# Altium schematic sheet ESP.SchDoc
size A4; SheetNumber: 2; SheetTotal: 9
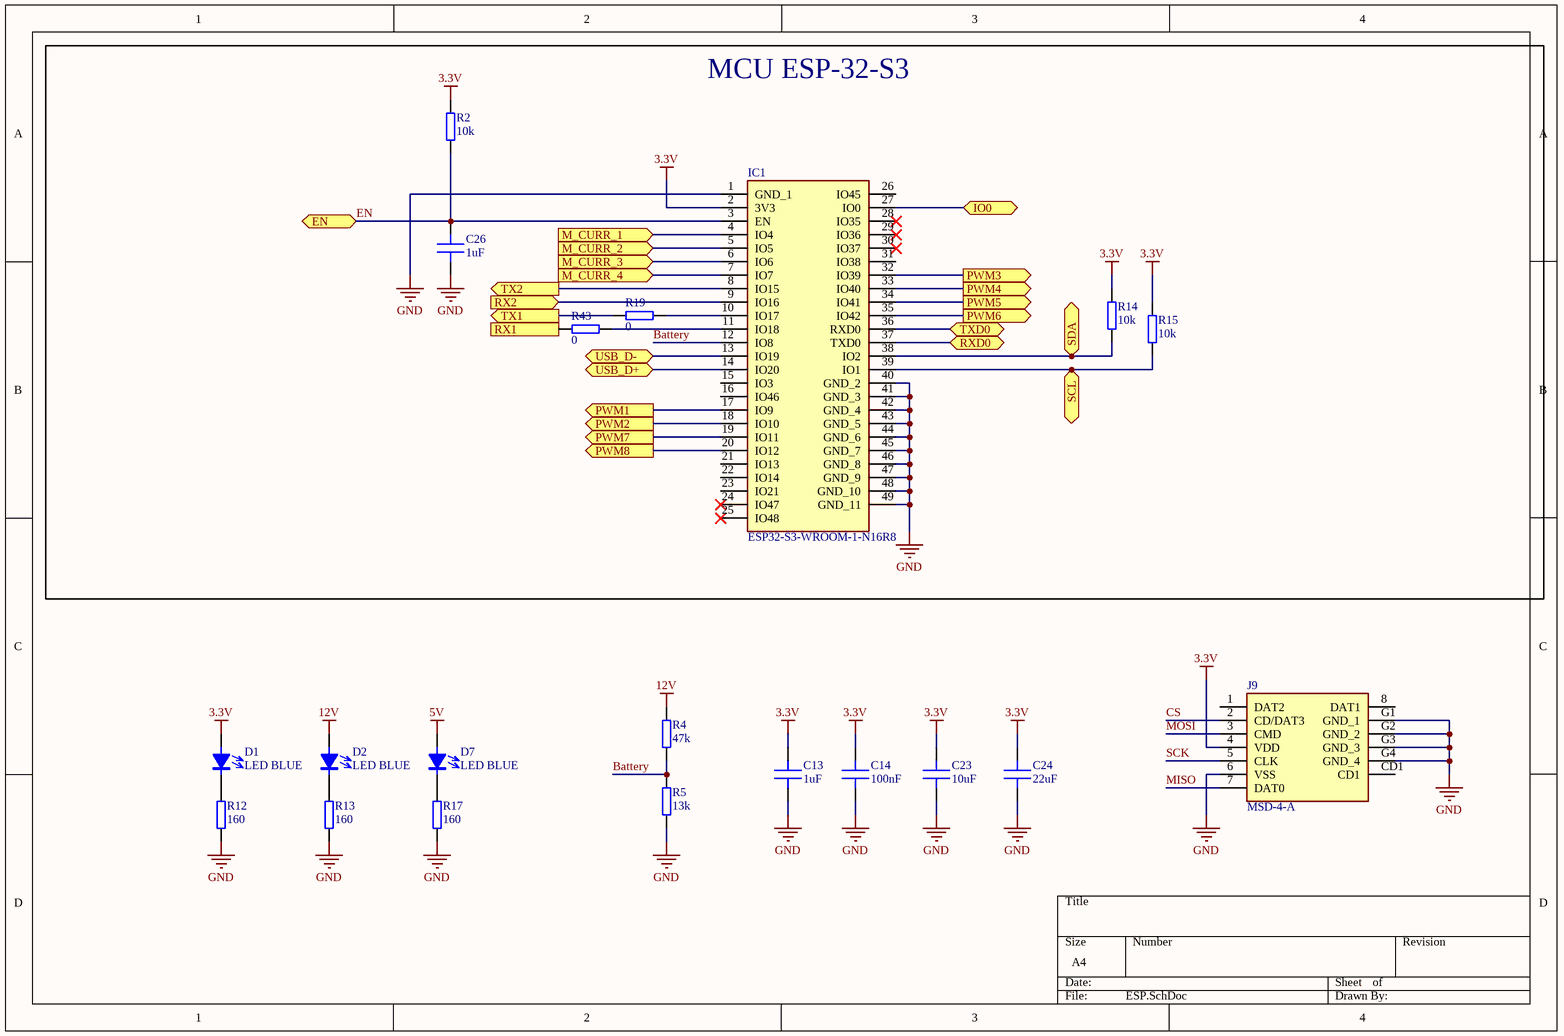
[diagram p0: ESP.SchDoc]

## Parts
C13  1uF  [C 0402]
C14  100nF  [C 0402]
C23  10uF  [C 0402]
C24  22uF  [C 0402]
C26  1uF  [C 0402]
D1  LED BLUE  [LED 0603 BLUE]
D2  LED BLUE  [LED 0603 BLUE]
D7  LED BLUE  [LED 0603 BLUE]
IC1  ESP32-S3-WROOM-1-N16R8  [ESP32S3WROOM1N16R8]
J9  MSD-4-A  [MSD4A]
R2  10k  [R 0402]
R4  47k  [R 0402]
R5  13k  [R 0402]
R12  160  [R 0402]
R13  160  [R 0402]
R14  10k  [R 0402]
R15  10k  [R 0402]
R17  160  [R 0402]
R19  0  [R 0402]
R43  0  [R 0402]

## Blocks framed on the sheet
MCU ESP-32-S3: C26 IC1 R2 R14 R15 R19 R43

## Ports
EN (bidir), IO0 (bidir), M_CURR_1 (in), M_CURR_2 (in), M_CURR_3 (in), M_CURR_4 (in), PWM1 (out), PWM2 (out), PWM3 (out), PWM4 (out), PWM5 (out), PWM6 (out), PWM7 (out), PWM8 (out), RX1 (in), RX2 (in), RXD0 (bidir), SCL (bidir), SDA (bidir), TX1 (out), TX2 (out), TXD0 (bidir), USB_D+ (bidir), USB_D- (bidir)

## Nets
3.3V: C13.1 C14.1 C23.1 C24.1 D1.1 IC1.2(3V3) J9.4(VDD) R2.2 R14.2 R15.2
5V: D7.1
12V: D2.1 R4.2
GND: C13.2 C14.2 C23.2 C24.2 C26.2 IC1.1(GND_1) IC1.40(GND_2) IC1.41(GND_3) IC1.42(GND_4) IC1.43(GND_5) IC1.44(GND_6) IC1.45(GND_7) IC1.46(GND_8) IC1.47(GND_9) IC1.48(GND_10) IC1.49(GND_11) J9.6(VSS) J9.G1(GND_1) J9.G2(GND_2) J9.G3(GND_3) J9.G4(GND_4) R5.1 R12.1 R13.1 R17.1
Battery: IC1.12(IO8) R4.1 R5.2
CS: J9.2(CD/DAT3)
EN: C26.1 IC1.3(EN) R2.1 ; port EN
IO0: IC1.27(IO0) ; port IO0
M_CURR_1: IC1.4(IO4) ; port M_CURR_1
M_CURR_2: IC1.5(IO5) ; port M_CURR_2
M_CURR_3: IC1.6(IO6) ; port M_CURR_3
M_CURR_4: IC1.7(IO7) ; port M_CURR_4
MISO: J9.7(DAT0)
MOSI: J9.3(CMD)
PWM1: IC1.17(IO9) ; port PWM1
PWM2: IC1.18(IO10) ; port PWM2
PWM3: IC1.32(IO39) ; port PWM3
PWM4: IC1.33(IO40) ; port PWM4
PWM5: IC1.34(IO41) ; port PWM5
PWM6: IC1.35(IO42) ; port PWM6
PWM7: IC1.19(IO11) ; port PWM7
PWM8: IC1.20(IO12) ; port PWM8
RX1: R43.2 ; port RX1
RX2: IC1.9(IO16) ; port RX2
RXD0: IC1.37(TXD0) ; port RXD0
SCK: J9.5(CLK)
SCL: IC1.39(IO1) R15.1 ; port SCL
SDA: IC1.38(IO2) R14.1 ; port SDA
TX1: R19.2 ; port TX1
TX2: IC1.8(IO15) ; port TX2
TXD0: IC1.36(RXD0) ; port TXD0
USB_D+: IC1.14(IO20) ; port USB_D+
USB_D-: IC1.13(IO19) ; port USB_D-
NetD1_2: D1.2 R12.2
NetD2_2: D2.2 R13.2
NetD7_2: D7.2 R17.2
NetIC1_10: IC1.10(IO17) R19.1
NetIC1_11: IC1.11(IO18) R43.1

Not connected (* = marked no-connect by the designer): IC1 15(IO3) 16(IO46) 21(IO13) 22(IO14) 23(IO21) 24(IO47)* 25(IO48)* 26(IO45) 28(IO35)* 29(IO36)* 30(IO37)* 31(IO38); J9 1(DAT2) 8(DAT1) CD1

## Library data of the parts
C13 C14 C23 C24 C26 = Capacitor: MLCC Capacitor
IC1 = ESP32-S3-WROOM-1-N16R8: Integrated Circuit; Manufacturer_Name: Espressif Systems; Datasheet Link: https://www.espressif.com/sites/default/files/documentation/esp32-s3-wroom-1_wroom-1u_datasheet_en.pdf; Height: 3.25mm; Manufacturer_Part_Number: ESP32-S3-WROOM-1-N16R8; Mouser Part Number: 356-ESP32S3WRM1N16R8; Mouser Price/Stock: https://www.mouser.co.uk/ProductDetail/Espressif-Systems/ESP32-S3-WROOM-1-N16R8?qs=Li%252BoUPsLEnvQc9gW6AMhZg%3D%3D
J9 = MSD-4-A: Connector; Manufacturer_Name: Same Sky; Datasheet Link: https://www.sameskydevices.com/product/resource/msd-4-a.pdf; Height: 2mm; Manufacturer_Part_Number: MSD-4-A; Mouser Part Number: 179-MSD-4-A; Mouser Price/Stock: https://www.mouser.co.uk/ProductDetail/Same-Sky/MSD-4-A?qs=Z%252BL2brAPG1Jll%252BQTi%252Btupg%3D%3D; Arrow Part Number: MSD-4-A; Arrow Price/Stock: https://www.arrow.com/en/products/msd-4-a/cui-devices?utm_currency=USD&region=nac
R2 R4 R5 R12-R15 R17 R19 R43 = Resistor: General pourpouse resistor